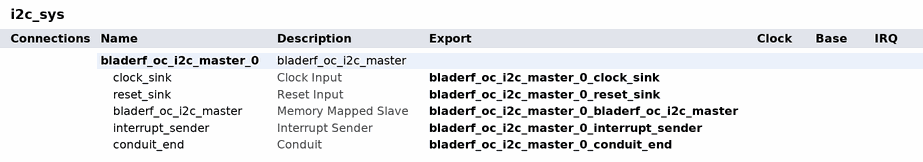
[diagram p0: system contents]
# Platform Designer (Qsys) system i2c_sys, Cyclone V 5CEBA4F23C8
# Parameters at their usual value, and those the tool derives, are not listed.
package require qsys
create_system i2c_sys
set_project_property DEVICE_FAMILY {Cyclone V}
set_project_property DEVICE 5CEBA4F23C8

add_instance bladerf_oc_i2c_master_0 bladerf_oc_i2c_master 1.0
set_instance_parameter_value bladerf_oc_i2c_master_0 ARST_LVL 1

# exported interfaces
add_interface bladerf_oc_i2c_master_0_bladerf_oc_i2c_master avalon slave
set_interface_property bladerf_oc_i2c_master_0_bladerf_oc_i2c_master EXPORT_OF bladerf_oc_i2c_master_0.bladerf_oc_i2c_master
add_interface bladerf_oc_i2c_master_0_clock_sink clock sink
set_interface_property bladerf_oc_i2c_master_0_clock_sink EXPORT_OF bladerf_oc_i2c_master_0.clock_sink
add_interface bladerf_oc_i2c_master_0_conduit_end conduit end
set_interface_property bladerf_oc_i2c_master_0_conduit_end EXPORT_OF bladerf_oc_i2c_master_0.conduit_end
add_interface bladerf_oc_i2c_master_0_interrupt_sender interrupt sender
set_interface_property bladerf_oc_i2c_master_0_interrupt_sender EXPORT_OF bladerf_oc_i2c_master_0.interrupt_sender
add_interface bladerf_oc_i2c_master_0_reset_sink reset sink
set_interface_property bladerf_oc_i2c_master_0_reset_sink EXPORT_OF bladerf_oc_i2c_master_0.reset_sink

set_interconnect_requirement {$system} qsys_mm.clockCrossingAdapter HANDSHAKE
set_interconnect_requirement {$system} qsys_mm.enableEccProtection FALSE
set_interconnect_requirement {$system} qsys_mm.insertDefaultSlave FALSE
set_interconnect_requirement {$system} qsys_mm.maxAdditionalLatency 1

save_system i2c_sys.qsys
